# Altium schematic sheet SOLEDNOID.SchDoc
size 420 x 297 mm; SheetNumber: 18; SheetTotal: 21
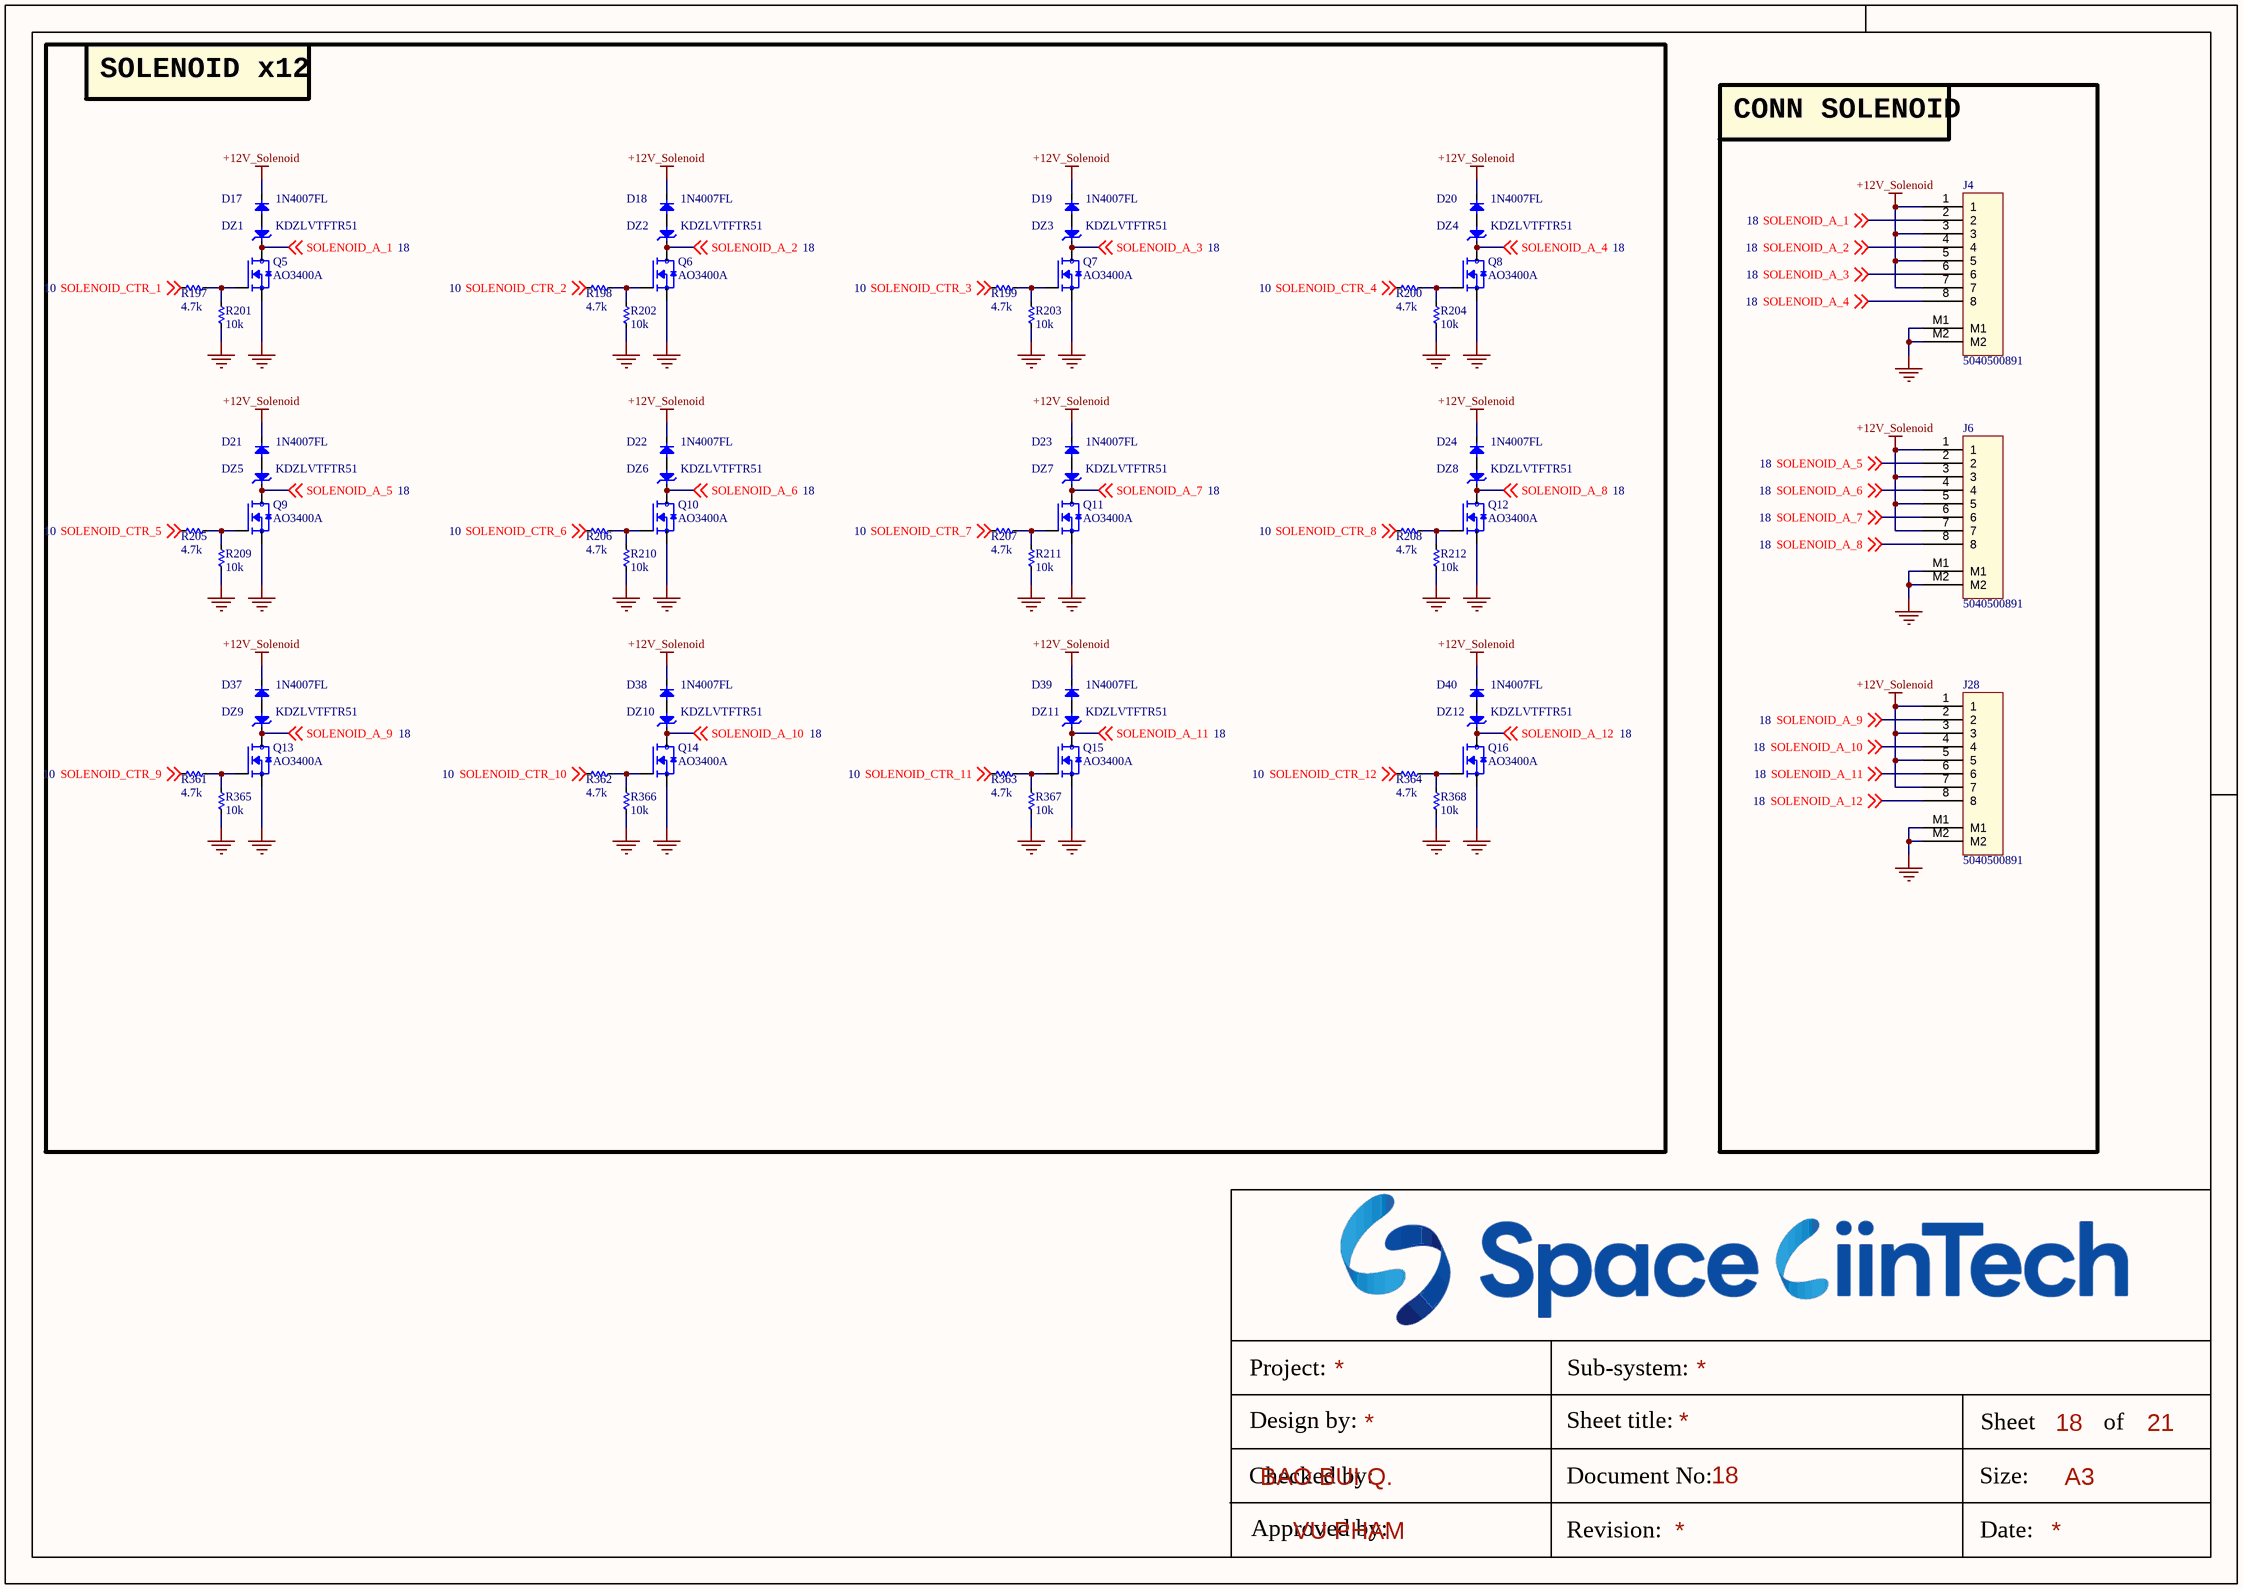
[diagram p0: SOLEDNOID.SchDoc]

## Parts
D17  1N4007FL  [SOD3717X145N]
D18  1N4007FL  [SOD3717X145N]
D19  1N4007FL  [SOD3717X145N]
D20  1N4007FL  [SOD3717X145N]
D21  1N4007FL  [SOD3717X145N]
D22  1N4007FL  [SOD3717X145N]
D23  1N4007FL  [SOD3717X145N]
D24  1N4007FL  [SOD3717X145N]
D37  1N4007FL  [SOD3717X145N]
D38  1N4007FL  [SOD3717X145N]
D39  1N4007FL  [SOD3717X145N]
D40  1N4007FL  [SOD3717X145N]
DZ1  KDZLVTFTR51  [SOD3717X145N]
DZ2  KDZLVTFTR51  [SOD3717X145N]
DZ3  KDZLVTFTR51  [SOD3717X145N]
DZ4  KDZLVTFTR51  [SOD3717X145N]
DZ5  KDZLVTFTR51  [SOD3717X145N]
DZ6  KDZLVTFTR51  [SOD3717X145N]
DZ7  KDZLVTFTR51  [SOD3717X145N]
DZ8  KDZLVTFTR51  [SOD3717X145N]
DZ9  KDZLVTFTR51  [SOD3717X145N]
DZ10  KDZLVTFTR51  [SOD3717X145N]
DZ11  KDZLVTFTR51  [SOD3717X145N]
DZ12  KDZLVTFTR51  [SOD3717X145N]
J4  5040500891  [MOLEX_5040500891]
J6  5040500891  [MOLEX_5040500891]
J28  5040500891  [MOLEX_5040500891]
Q5  AO3400A  [SOT95P240X120-3N]
Q6  AO3400A  [SOT95P240X120-3N]
Q7  AO3400A  [SOT95P240X120-3N]
Q8  AO3400A  [SOT95P240X120-3N]
Q9  AO3400A  [SOT95P240X120-3N]
Q10  AO3400A  [SOT95P240X120-3N]
Q11  AO3400A  [SOT95P240X120-3N]
Q12  AO3400A  [SOT95P240X120-3N]
Q13  AO3400A  [SOT95P240X120-3N]
Q14  AO3400A  [SOT95P240X120-3N]
Q15  AO3400A  [SOT95P240X120-3N]
Q16  AO3400A  [SOT95P240X120-3N]
R197  4.7k  [RES_C_1005X40]
R198  4.7k  [RES_C_1005X40]
R199  4.7k  [RES_C_1005X40]
R200  4.7k  [RES_C_1005X40]
R201  10k  [RES_C_1005X40]
R202  10k  [RES_C_1005X40]
R203  10k  [RES_C_1005X40]
R204  10k  [RES_C_1005X40]
R205  4.7k  [RES_C_1005X40]
R206  4.7k  [RES_C_1005X40]
R207  4.7k  [RES_C_1005X40]
R208  4.7k  [RES_C_1005X40]
R209  10k  [RES_C_1005X40]
R210  10k  [RES_C_1005X40]
R211  10k  [RES_C_1005X40]
R212  10k  [RES_C_1005X40]
R361  4.7k  [RES_C_1005X40]
R362  4.7k  [RES_C_1005X40]
R363  4.7k  [RES_C_1005X40]
R364  4.7k  [RES_C_1005X40]
R365  10k  [RES_C_1005X40]
R366  10k  [RES_C_1005X40]
R367  10k  [RES_C_1005X40]
R368  10k  [RES_C_1005X40]

## Blocks framed on the sheet
SOLENOID x12: D17-D24 D37-D40 DZ1-DZ12 Q5-Q16 R197-R212 R361-R368
CONN SOLENOID: J4 J6 J28

## Nets
+12V_Solenoid: D17.1(K) D18.1(K) D19.1(K) D20.1(K) D21.1(K) D22.1(K) D23.1(K) D24.1(K) D37.1(K) D38.1(K) D39.1(K) D40.1(K) J4.1 J4.3 J4.5 J4.7 J6.1 J6.3 J6.5 J6.7 J28.1 J28.3 J28.5 J28.7
GND: J4.M1 J4.M2 J6.M1 J6.M2 J28.M1 J28.M2 Q5.2(S) Q6.2(S) Q7.2(S) Q8.2(S) Q9.2(S) Q10.2(S) Q11.2(S) Q12.2(S) Q13.2(S) Q14.2(S) Q15.2(S) Q16.2(S) R201.1 R202.1 R203.1 R204.1 R209.1 R210.1 R211.1 R212.1 R365.1 R366.1 R367.1 R368.1
SOLENOID_A_1: DZ1.1(K) J4.2 Q5.3(D) ; off-sheet SOLENOID_A_1
SOLENOID_A_2: DZ2.1(K) J4.4 Q6.3(D) ; off-sheet SOLENOID_A_2
SOLENOID_A_3: DZ3.1(K) J4.6 Q7.3(D) ; off-sheet SOLENOID_A_3
SOLENOID_A_4: DZ4.1(K) J4.8 Q8.3(D) ; off-sheet SOLENOID_A_4
SOLENOID_A_5: DZ5.1(K) J6.2 Q9.3(D) ; off-sheet SOLENOID_A_5
SOLENOID_A_6: DZ6.1(K) J6.4 Q10.3(D) ; off-sheet SOLENOID_A_6
SOLENOID_A_7: DZ7.1(K) J6.6 Q11.3(D) ; off-sheet SOLENOID_A_7
SOLENOID_A_8: DZ8.1(K) J6.8 Q12.3(D) ; off-sheet SOLENOID_A_8
SOLENOID_A_9: DZ9.1(K) J28.2 Q13.3(D) ; off-sheet SOLENOID_A_9
SOLENOID_A_10: DZ10.1(K) J28.4 Q14.3(D) ; off-sheet SOLENOID_A_10
SOLENOID_A_11: DZ11.1(K) J28.6 Q15.3(D) ; off-sheet SOLENOID_A_11
SOLENOID_A_12: DZ12.1(K) J28.8 Q16.3(D) ; off-sheet SOLENOID_A_12
SOLENOID_CTR_1: R197.2 ; off-sheet SOLENOID_CTR_1
SOLENOID_CTR_2: R198.2 ; off-sheet SOLENOID_CTR_2
SOLENOID_CTR_3: R199.2 ; off-sheet SOLENOID_CTR_3
SOLENOID_CTR_4: R200.2 ; off-sheet SOLENOID_CTR_4
SOLENOID_CTR_5: R205.2 ; off-sheet SOLENOID_CTR_5
SOLENOID_CTR_6: R206.2 ; off-sheet SOLENOID_CTR_6
SOLENOID_CTR_7: R207.2 ; off-sheet SOLENOID_CTR_7
SOLENOID_CTR_8: R208.2 ; off-sheet SOLENOID_CTR_8
SOLENOID_CTR_9: R361.2 ; off-sheet SOLENOID_CTR_9
SOLENOID_CTR_10: R362.2 ; off-sheet SOLENOID_CTR_10
SOLENOID_CTR_11: R363.2 ; off-sheet SOLENOID_CTR_11
SOLENOID_CTR_12: R364.2 ; off-sheet SOLENOID_CTR_12
NetD17_2: D17.2(A) DZ1.2(A)
NetD18_2: D18.2(A) DZ2.2(A)
NetD19_2: D19.2(A) DZ3.2(A)
NetD20_2: D20.2(A) DZ4.2(A)
NetD21_2: D21.2(A) DZ5.2(A)
NetD22_2: D22.2(A) DZ6.2(A)
NetD23_2: D23.2(A) DZ7.2(A)
NetD24_2: D24.2(A) DZ8.2(A)
NetD37_2: D37.2(A) DZ9.2(A)
NetD38_2: D38.2(A) DZ10.2(A)
NetD39_2: D39.2(A) DZ11.2(A)
NetD40_2: D40.2(A) DZ12.2(A)
NetQ5_1: Q5.1(G) R197.1 R201.2
NetQ6_1: Q6.1(G) R198.1 R202.2
NetQ7_1: Q7.1(G) R199.1 R203.2
NetQ8_1: Q8.1(G) R200.1 R204.2
NetQ9_1: Q9.1(G) R205.1 R209.2
NetQ10_1: Q10.1(G) R206.1 R210.2
NetQ11_1: Q11.1(G) R207.1 R211.2
NetQ12_1: Q12.1(G) R208.1 R212.2
NetQ13_1: Q13.1(G) R361.1 R365.2
NetQ14_1: Q14.1(G) R362.1 R366.2
NetQ15_1: Q15.1(G) R363.1 R367.2
NetQ16_1: Q16.1(G) R364.1 R368.2

## Notes on the sheet
- Project:
- Sub-system:
- Design by:
- BAO BUI Q.
- Sheet title:
- Sheet
- A3
- of
- Checked by:
- Approved by:
- VU PHAM
- Revision:
- Document No:
- Size:
- Date:

## Library data of the parts
D17-D24 D37-D40 = Diode SMD: Default Diode; Code - JEDEC: DO-214-AB; Value: 1N5007; Published: 8-Jun-2000; Revision: July-2002: Re-released for DXP Platform.; Publisher: Altium Limited
DZ1-DZ12 = DIODE Zener: Zenner
J4 J6 J28 = Header 8x1_2M
Q5-Q16 = MOSFET_N: N-Channel 30 V 5.7A (Ta) 1.4W (Ta) Surface Mount SOT-23-3; MF: Alpha & Omega Semiconductor; SnapEDA_Link: https://www.snapeda.com/parts/AO3400A/Alpha/view-part/?ref=snap; Package: SOT-23 Alpha &amp; Omega Semiconductor Inc.; Value: *; MP: AO3400A; Check_prices: https://www.snapeda.com/parts/AO3400A/Alpha/view-part/?ref=eda
R197-R212 R361-R368 = _RES_B_2: RES